# EasyEDA schematic stopwatch.json
TITLE: STOPWATCH_BabyRTOS; REV: 1.0; Date: 2023-06-18; Sheet: 1/1; Company: hazemanwer2000
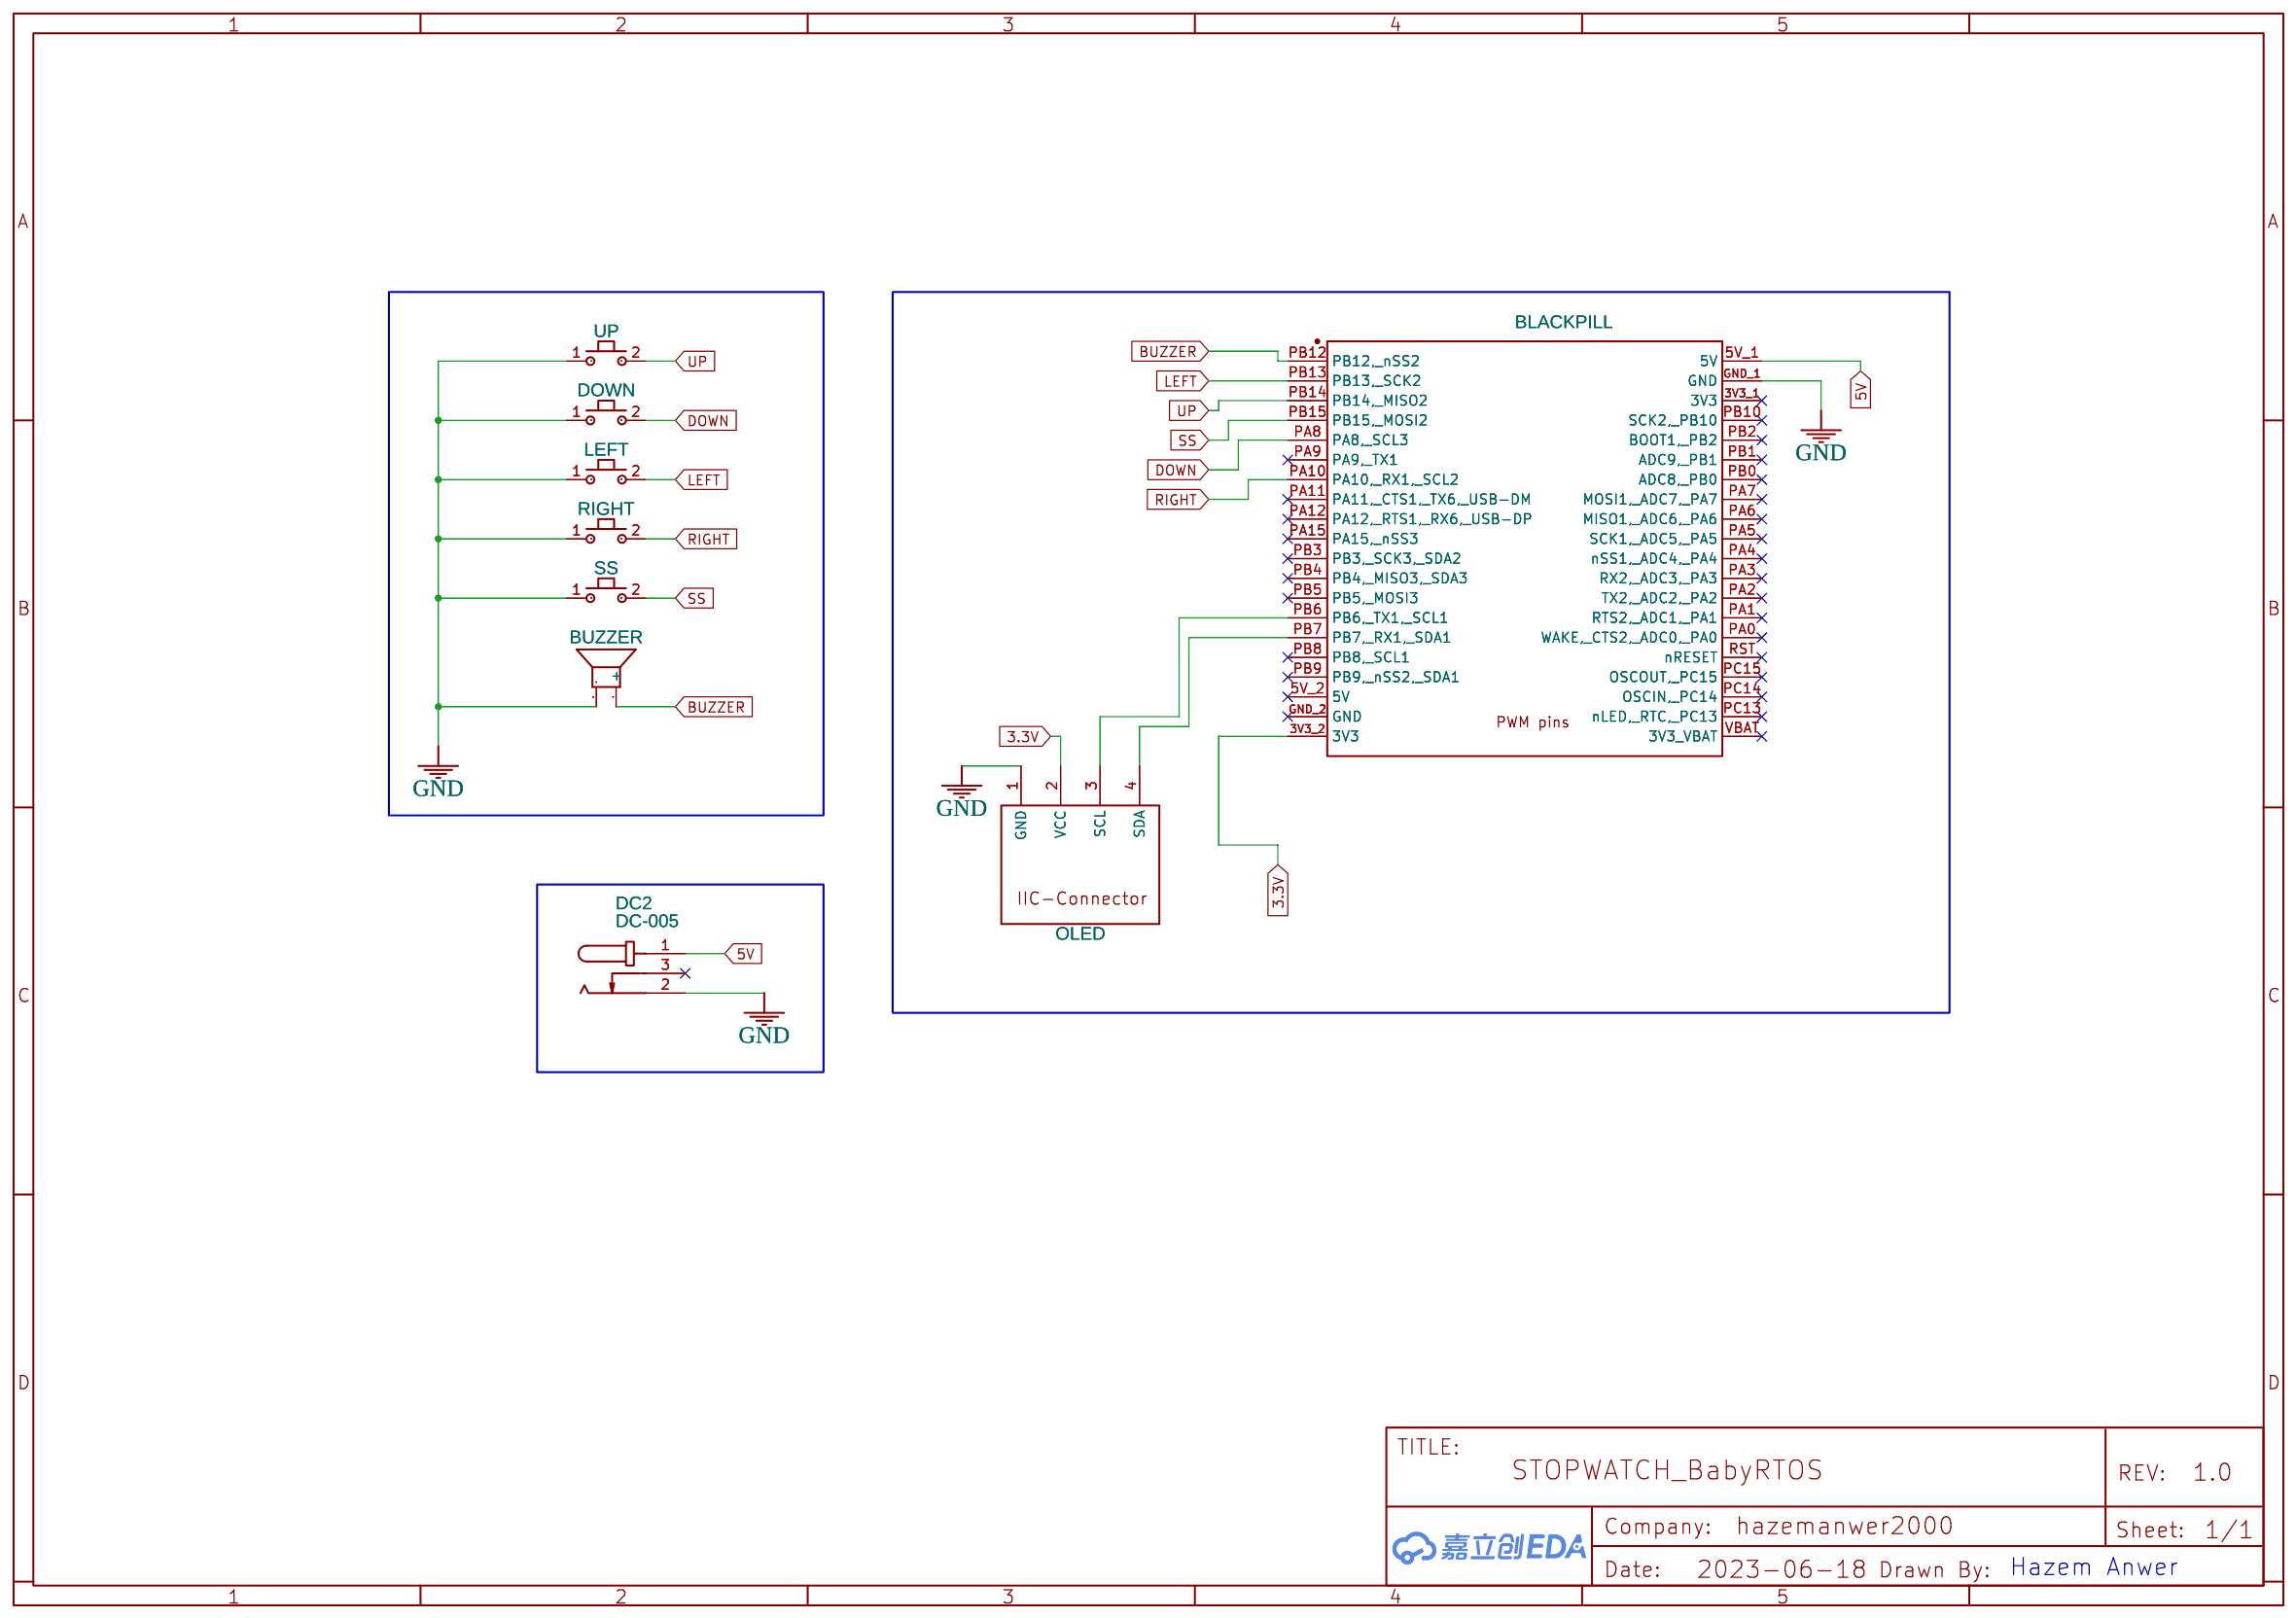
[diagram p0: schematic sheet]

## Parts
BLACKPILL  STM32F401CC Black Pill Module  [STM32_BLACKPILL_F4XX]
BUZZER  BUZZER-12X9  [BUZ-TH_BD12.0-P7.60-D0.6-FD]
DC2  DC-005  [DC-IN-TH_DC-005-A]
DOWN  CMI625501D06  [SW-TH_2P-L6.2-W6.2-P5.0]
LEFT  CMI625501D06  [SW-TH_2P-L6.2-W6.2-P5.0]
OLED  0.96OLED_4P_MODULE_JX  [0.96OLED_4P]
RIGHT  CMI625501D06  [SW-TH_2P-L6.2-W6.2-P5.0]
SS  CMI625501D06  [SW-TH_2P-L6.2-W6.2-P5.0]
UP  CMI625501D06  [SW-TH_2P-L6.2-W6.2-P5.0]

## Library data of the parts
BLACKPILL = STM32F401CC Black Pill Module: Manufacturer: Blackpill; Manufacturer Part: Blackpill; Supplier Part: NA; Contributor: WernickiDesign
BUZZER = BUZZER-12X9: Supplier: LCSC; Supplier Part: C9900016920; Manufacturer: null; Manufacturer Part: buzzer-12X9; Contributor: lcsc; JLCPCB Part Class: Extended Part
DC2 = DC-005: Supplier: LCSC; Supplier Part: C9900004933; Manufacturer: null; JLCPCB Part Class: Extended Part; Contributor: LCSC
DOWN LEFT RIGHT SS UP = CMI625501D06: Supplier: LCSC; Supplier Part: C400265; Manufacturer: Kailh(凯华); Contributor: LCSC; JLCPCB Part Class: Extended Part
OLED = 0.96OLED_4P_MODULE_JX: Supplier: LCSC; Supplier Part: C9900004566; Manufacturer: null; Contributor: LCSC; JLCPCB Part Class: Extended Part

## Nets
3.3V: BLACKPILL.3V3_2(3V3) OLED.2(VCC)
5V: BLACKPILL.5V_1(5V) DC2.1
GND: BLACKPILL.GND_1(GND) BUZZER.2 DC2.2 DOWN.1 LEFT.1 OLED.1(GND) RIGHT.1 SS.1 UP.1
BUZZER: BLACKPILL.PB12(PB12, nSS2) BUZZER.1(+)
DOWN: BLACKPILL.PA8(PA8, SCL3) DOWN.2
LEFT: BLACKPILL.PB13(PB13, SCK2) LEFT.2
RIGHT: BLACKPILL.PA10(PA10, RX1, SCL2) RIGHT.2
SS: BLACKPILL.PB15(PB15, MOSI2) SS.2
UP: BLACKPILL.PB14(PB14, MISO2) UP.2
Net-(BLACKPILL-PB6): BLACKPILL.PB6(PB6, TX1, SCL1) OLED.3(SCL)
Net-(BLACKPILL-PB7): BLACKPILL.PB7(PB7, RX1, SDA1) OLED.4(SDA)

Not connected (* = marked no-connect by the designer): BLACKPILL 3V3_1(3V3)* 5V_2(5V)* GND_2(GND)* PA0(WAKE, CTS2, ADC0, PA0)* PA1(RTS2, ADC1, PA1)* PA2(TX2, ADC2, PA2)* PA3(RX2, ADC3, PA3)* PA4(nSS1, ADC4, PA4)* PA5(SCK1, ADC5, PA5)* PA6(MISO1, ADC6, PA6)* PA7(MOSI1, ADC7, PA7)* PA9(PA9, TX1)* PA11(PA11, CTS1, TX6, USB-DM)* PA12(PA12, RTS1, RX6, USB-DP)* PA15(PA15, nSS3)* PB0(ADC8, PB0)* PB1(ADC9, PB1)* PB2(BOOT1, PB2)* PB3(PB3, SCK3, SDA2)* PB4(PB4, MISO3, SDA3)* PB5(PB5, MOSI3)* PB8(PB8, SCL1)* PB9(PB9, nSS2, SDA1)* PB10(SCK2, PB10)* PC13(nLED, RTC, PC13)* PC14(OSCIN, PC14)* PC15(OSCOUT, PC15)* RST(nRESET)* VBAT(3V3 VBAT)*; DC2 3*

## Notes on the sheet
- Hazem Anwer
